# Altium schematic sheet BlockDiagram.SchDoc: 02290_Sonoma_Controller
size B; ApprovedBy: J Johnson; CheckedBy: J Johnson; Author: sdfasdfdfAEFfasdFfaF; DrawnBy: J Johnson; Organization: Opsero Electronic Design; Address1: 21-915 Av. Marguerite-Bourgeoys; Address2: Québec (QC); Address3: G1S 3X4; DocumentNumber: OP009-001-SCH; Revision: D-1; SheetNumber: 02; SheetTotal: 16; Tel1: (581) 308-8830; Tel2: (581) 308-8830; Project: 02290_Sonoma_Controller; CheckedDate: 2013-12-13; Sheet: Block diagram; PageSetup: Record=PageOptions|CenterHorizontal=True|CenterVertical=True|PrintScale=1.08|XCorrection=1.00|YCorrection=1.00|PrintKind=0|BorderSize=5000000|LeftOffset=0|BottomOffset=0|Orientation=2|PaperLength=1000|PaperWidth=1000|Scale=100|PaperSource=7|PrintQuality=-4|MediaType=1|DitherType=10|PaperKind=Tabloid     [11 x 17 in]|PrintScaleMode=1; DrawDate: 2013-12-13; SchTitle: 02290_Sonoma_Controller; RevDescription: Replaced Q2,Q3 with STD16NF06LT4; RevDate: 2020-07-07; RevBy: J Johnson; RevDescription2: Added resistors to QSPI interface; ModifiedDate: 2020-07-07
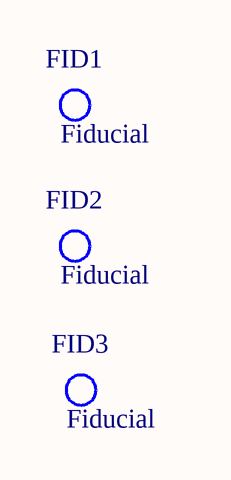
[diagram p0: BlockDiagram.SchDoc]

## Parts
FID1  FIDUCIAL  [FIDUCIAL15-30-TB]  (no BOM)
FID2  FIDUCIAL  [FIDUCIAL15-30-TB]  (no BOM)
FID3  FIDUCIAL  [FIDUCIAL15-30-TB]  (no BOM)

## Notes on the sheet
- REV.
- DESCRIPTION
- DATE
- APPROVED
- Incal Inc.
- SHEET
- TITLE
- CONFIG.
- PROJECT
- SIZE
- SCH P/N.
- DRAWN
- B
- OF

## Library data of the parts
FID1-FID3 = FIDU_15_30_TB: Fiducial, 1.5mm, 3.0mm ring; Manufacturer 1: Opsero; Status: Active; EIA(I) Package: *; EIA(M) Package: *; Tolerance: *; Package: *; RoHs: True; Part Ref: FIDU_15_30_TB; Datasheet 1: http://opsero.com; Mfg Part Number 1: FIDUCIAL; Value: Fiducial